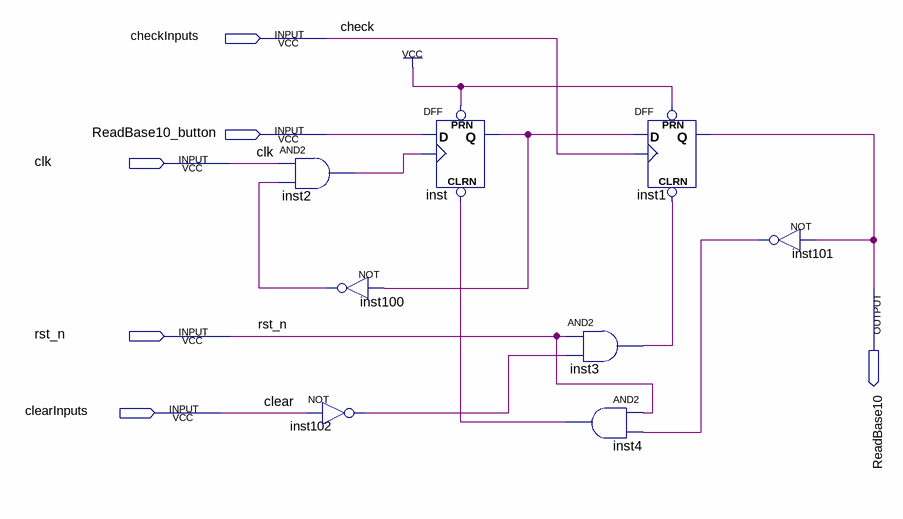
[diagram p0: schematic sheet]
// Quartus schematic input_reg.bdf as structural Verilog: 8 symbols, 6 pins
module input_reg (
  input  checkInputs,
  input  ReadBase10_button,
  input  clk,
  input  rst_n,
  input  clearInputs,
  output ReadBase10
);

  wire inst2_out, inst3_out, inst4_out, inst100_out, inst101_out, inst102_out, inst_q;

  and inst2 (inst2_out, clk, inst100_out);
  not inst100 (inst100_out, inst_q);
  not inst102 (inst102_out, clearInputs);
  DFF inst (.CLRN(inst4_out), .CLK(inst2_out), .D(ReadBase10_button), .PRN(1'b1), .Q(inst_q));
  and inst3 (inst3_out, rst_n, inst102_out);
  and inst4 (inst4_out, rst_n, inst101_out);
  DFF inst1 (.CLRN(inst3_out), .CLK(checkInputs), .D(inst_q), .PRN(1'b1), .Q(ReadBase10));
  not inst101 (inst101_out, ReadBase10);

  // Other names for the same wires on the sheet: check = checkInputs; clear = clearInputs
endmodule
